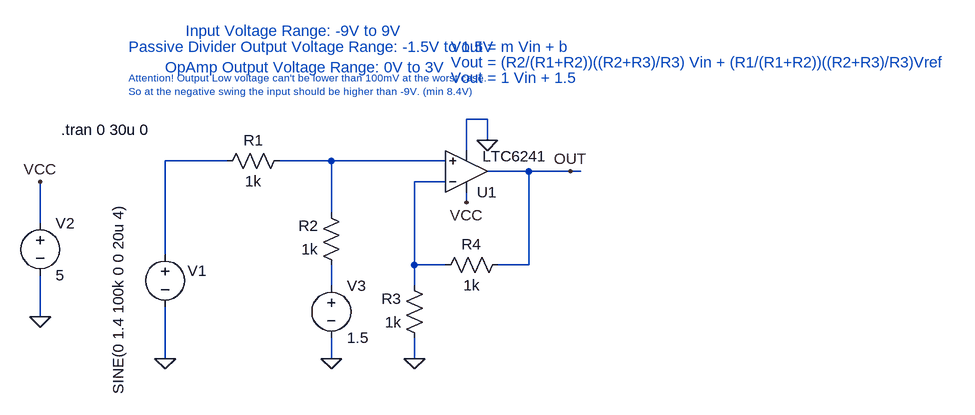
[diagram p0: schematic OpAmp_DiffInput.asc]
OpAmp_DiffInput.asc, the LTspice schematic file:
Version 4
SHEET 1 1004 680
WIRE 352 96 320 96
WIRE 352 128 352 96
WIRE 320 144 320 96
WIRE -48 160 -144 160
WIRE 112 160 32 160
WIRE 288 160 112 160
WIRE 416 176 352 176
WIRE 480 176 416 176
WIRE 496 176 480 176
WIRE 288 192 240 192
WIRE 320 224 320 208
WIRE 112 240 112 160
WIRE -336 256 -336 192
WIRE -144 304 -144 160
WIRE 240 320 240 192
WIRE 288 320 240 320
WIRE 416 320 416 176
WIRE 416 320 368 320
WIRE 112 352 112 320
WIRE 240 352 240 320
WIRE -336 400 -336 336
WIRE -144 464 -144 384
WIRE 112 464 112 432
WIRE 240 464 240 432
FLAG 352 128 0
FLAG -144 464 0
FLAG -336 400 0
FLAG -336 192 VCC
FLAG 320 224 VCC
FLAG 480 176 OUT
FLAG 240 464 0
FLAG 112 464 0
SYMBOL Opamps\\LTC6241 320 176 M180
WINDOW 3 25 23 Left 2
SYMATTR InstName U1
SYMBOL voltage -144 288 R0
WINDOW 0 35 41 Left 2
WINDOW 3 -72 -62 VRight 2
WINDOW 123 26 92 Left 2
WINDOW 39 0 0 Left 2
SYMATTR InstName V1
SYMATTR Value SINE(0 1.4 100k 0 0 20u 4)
SYMBOL voltage -336 240 R0
WINDOW 123 0 0 Left 2
WINDOW 39 0 0 Left 2
SYMATTR InstName V2
SYMATTR Value 5
SYMBOL res 384 304 R90
WINDOW 0 0 56 VBottom 2
WINDOW 3 32 56 VTop 2
SYMATTR InstName R4
SYMATTR Value 1k
SYMBOL res 256 448 R180
WINDOW 0 36 76 Left 2
WINDOW 3 36 40 Left 2
SYMATTR InstName R3
SYMATTR Value 1k
SYMBOL res 48 144 R90
WINDOW 0 0 56 VBottom 2
WINDOW 3 32 56 VTop 2
SYMATTR InstName R1
SYMATTR Value 1k
SYMBOL res 128 336 R180
WINDOW 0 36 76 Left 2
WINDOW 3 36 40 Left 2
SYMATTR InstName R2
SYMATTR Value 1k
SYMBOL voltage 112 336 R0
WINDOW 123 0 0 Left 2
WINDOW 39 0 0 Left 2
SYMATTR InstName V3
SYMATTR Value 1.5
TEXT -304 112 Left 2 !.tran 0 30u 0
TEXT -112 -40 Left 2 ;Input Voltage Range: -9V to 9V
TEXT -200 -16 Left 2 ;Passive Divider Output Voltage Range: -1.5V to 1.5V
TEXT -144 16 Left 2 ;OpAmp Output Voltage Range: 0V to 3V
TEXT -200 32 Left 1 ;Attention! Output Low voltage can't be lower than 100mV at the worst case.\nSo at the negative swing the input should be higher than -9V. (min 8.4V)
TEXT 296 -16 Left 2 ;Vout = m Vin + b
TEXT 296 8 Left 2 ;Vout = (R2/(R1+R2))((R2+R3)/R3) Vin + (R1/(R1+R2))((R2+R3)/R3)Vref
TEXT 296 32 Left 2 ;Vout = 1 Vin + 1.5

The netlist it stands for:
* OpAmp_DiffInput.asc
XU1 N002 N003 VCC 0 OUT LTC6241  ; pins In+ In- V+ V- OUT
V1 N001 0 SINE(0 1.4 100k 0 0 20u 4)
V2 VCC 0 5
R4 OUT N003 1k
R3 0 N003 1k
R1 N002 N001 1k
R2 N004 N002 1k
V3 N004 0 1.5
.tran 0 30u 0
* Input Voltage Range: -9V to 9V
* Passive Divider Output Voltage Range: -1.5V to 1.5V
* OpAmp Output Voltage Range: 0V to 3V
* Attention! Output Low voltage can't be lower than 100mV at the worst case.
* So at the negative swing the input should be higher than -9V. (min 8.4V)
* Vout = m Vin + b
* Vout = (R2/(R1+R2))((R2+R3)/R3) Vin + (R1/(R1+R2))((R2+R3)/R3)Vref
* Vout = 1 Vin + 1.5
.lib LTC4.lib
.backanno
.end